# EAGLE design ultra-violet-tooth-sensor-mk-3.3 (EAGLE 6.5.0)
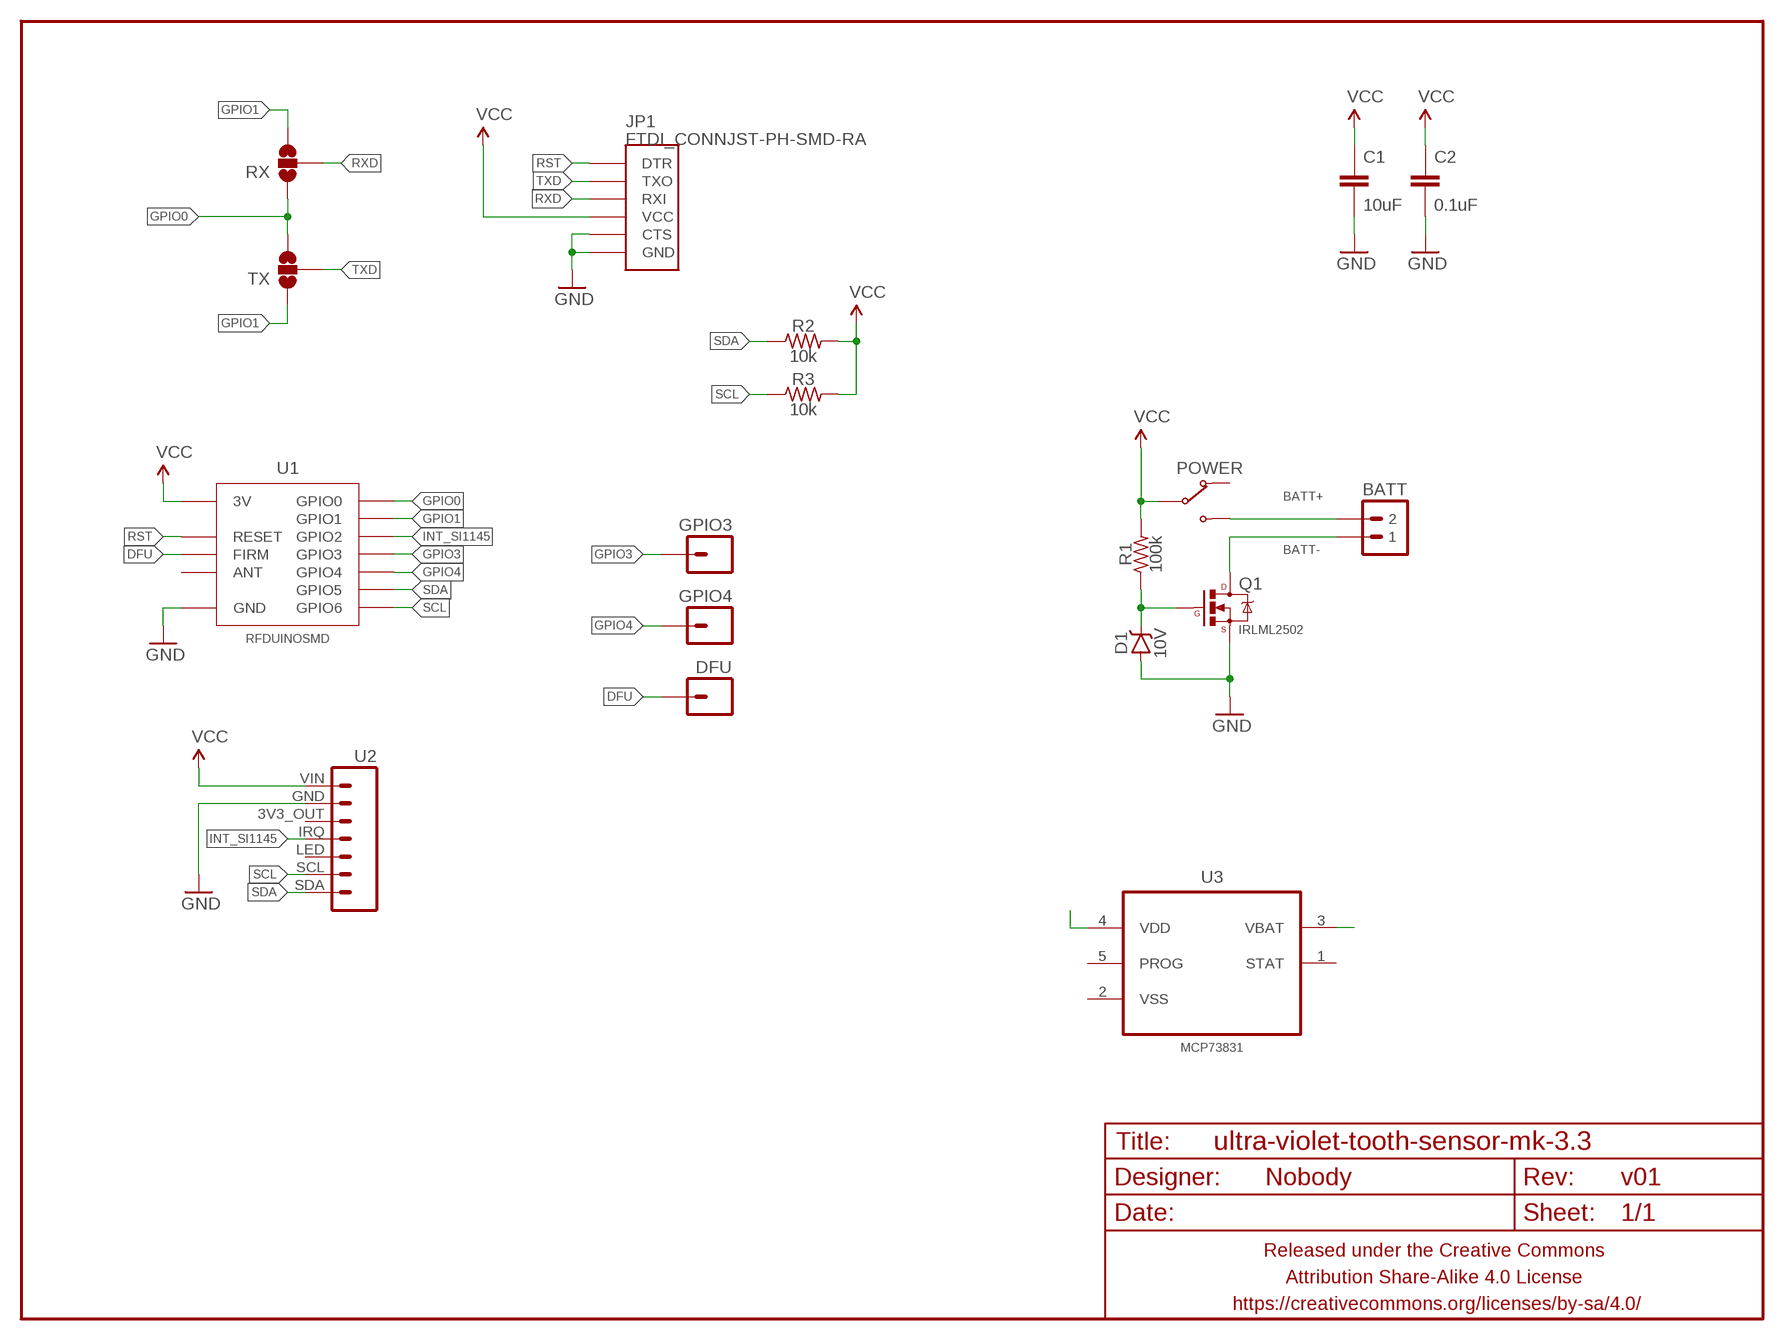
[diagram p0: schematic, sheet 1]

## Parts
BATT  M02PTH-CENTERED-R+  [1X02-CENTER-R+]
C1  10uF  CAPACITOR-CERAMICC1206  [C1206]
C2  0.1uF  CAPACITOR-CERAMICC0805  [C0805]
D1  10V  DIODE-ZENERSOT23  [SOT23]
DFU  M01SMD_1.5X2MM  [1X01_1.5X2MM]
FRAME1  FRAME-LETTERNO_PACKAGE  [DUMMY]
GPIO3  M01SMD_1.5X2MM  [1X01_1.5X2MM]
GPIO4  M01SMD_1.5X2MM  [1X01_1.5X2MM]
JP1  FTDI_CONNJST-PH-SMD-RA  [AVRISP-JST-6-PH-RA-SMD]
POWER  SWITCH-SPDTPTH-RA-2.54MM  [SPDT-RA-2.54MM]
Q1  IRLML2502  MOSFET-NCHANNELIRLML2502  [SOT23]
R1  100k  RESISTORR0805  [R0805]
R2  10k  RESISTORR0805  [R0805]
R3  10k  RESISTORR0805  [R0805]
RX  JUMPER-PAD-3-NOFULL_BOX_SILK  [PAD-JUMPER-3-NO_YES_SILK_FULL_BOX]
TX  JUMPER-PAD-3-NOFULL_BOX_SILK  [PAD-JUMPER-3-NO_YES_SILK_FULL_BOX]
U1  RFDUINOSMD  [RFDUINO-SMD]
U2  ADAFRUIT-SI1145-BREAKOUTNOHOLEY  [ADAFRUIT-SI1145-BREAKOUT-NOHOLES]
U3  MCP73831  MCP73831T-2ACI/OT  [SOT95P280X145-5N]

## Nets
BATT+: BATT.2 POWER.3(NO)
BATT-: BATT.1 Q1.3(D)
DFU: DFU.P$1 U1.FACTORY(FIRM)
GND: C1.2 C2.2 D1.1(A) D1.2(A) JP1.CTS JP1.GND Q1.2(S) U1.GND@1(GND) U1.GND@2(GND) U1.GND@3(GND) U1.GND@4(GND) U1.GND@5(GND) U1.GND@6(GND) U1.GND@7(GND) U1.GND@8(GND) U2.GND
GPIO0: RX.1 TX.3 U1.GPIO0
GPIO1: RX.3 TX.1 U1.GPIO1
GPIO3: GPIO3.P$1 U1.GPIO3
GPIO4: GPIO4.P$1 U1.GPIO4
INT_SI1145: U1.GPIO2 U2.IRQ
N$1: U3.3(VBAT)
N$3: U3.4(VDD)
N$4: D1.3(C) Q1.1(G) R1.1
RST: JP1.DTR U1.RESET
RXD: JP1.RXI RX.2
SCL: R3.1 U1.GPIO6 U2.SCL
SDA: R2.1 U1.GPIO5 U2.SDA
TXD: JP1.TXO TX.2
VCC: C1.1 C2.1 JP1.VCC POWER.2(COM) R1.2 R2.2 R3.2 U1.3V U2.VIN
Unconnected: POWER.1(NC) U1.ANT U2.3V3_OUT U2.LED U3.1(STAT) U3.5(PROG)

## Power pins joined to a net without a drawn wire
VSS: U3.2(VSS)

## Library data of the parts
BATT = A_butts:M02: Standard 2-pin 0.1" header. Use with - straight break away headers ( PRT-00116) - right angle break away headers (PRT-00553) - swiss pins (PRT-00743) - machine pins (PRT-00117) - female headers (PRT-00115) Molex polarized connector foot print use with: PRT-08233 with associated crimp pins and housings. 2.54_SCREWTERM for use with PRT-10571. 3.5mm Screw Terminal footprints for PRT-08084 5mm Screw Terminal footprints for use with PRT-08433
C1 C2 = A_butts:CAPACITOR-CERAMIC: CAPACITOR, European symbol
D1 = A_butts:DIODE-ZENER: Zener Diode Production Part - 8199 3.4V Zener Voltage
DFU GPIO3 GPIO4 = A_butts:M01: Header 1 Standard 1-pin 0.1" header. Use with straight break away headers (SKU : PRT-00116), right angle break away headers (PRT-00553), swiss pins (PRT-00743), machine pins (PRT-00117), and female headers (PRT-00115).
FRAME1 = A_butts:FRAME-LETTER: Schematic Frame Standard 8.5x11 US Letter frame; DESIGNER: Nobody; VERSION: v01
JP1 = A_butts:FTDI_CONN: Connector which mates to FTDI basic or FTDI cable.
POWER = A_butts:SWITCH-SPDT
Q1 = A_butts:MOSFET-NCHANNEL: Common NMOSFET Parts MFG P/N Store ID Prod ID FDD8780 TRANS-09984 SI7820DN TRANS-11055 FDS6630A IC-08089 2N7002PW TRANS-11151 FQP30N06L COM-10213 TRANS-10060 BSS123LT1G TRANS-08345 BSS138 TRANS-00830 BS170 2N7000
R1-R3 = A_butts:RESISTOR: RESISTOR, American symbol
RX TX = A_butts:JUMPER-PAD-3-NO
U1 = A_butts:RFDUINO
U2 = A_butts:ADAFRUIT-SI1145-BREAKOUT
U3 = A_butts:MCP73831T-2ACI/OT: Charge Management Controller; MPN: MCP73831T-2ACI/OT; OC_FARNELL: 1332158; OC_NEWARK: 56K7045; PACKAGE: SOT-5; SUPPLIER: Microchip

## Board
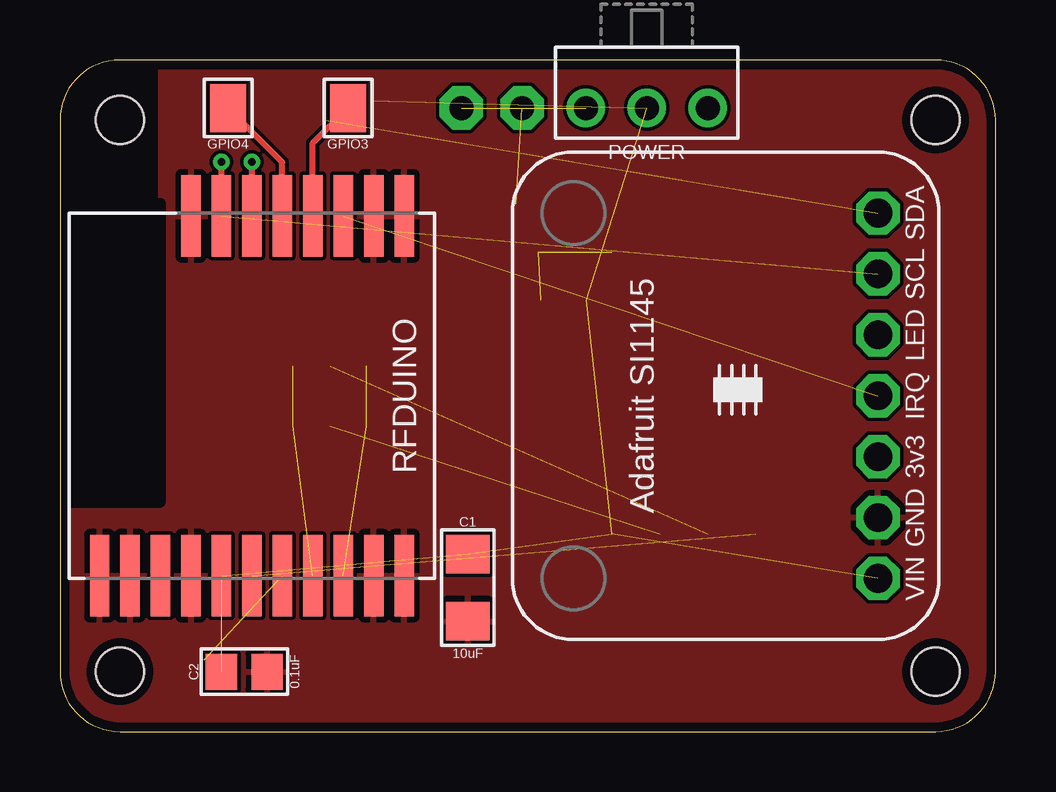
[diagram p1: board, top side]
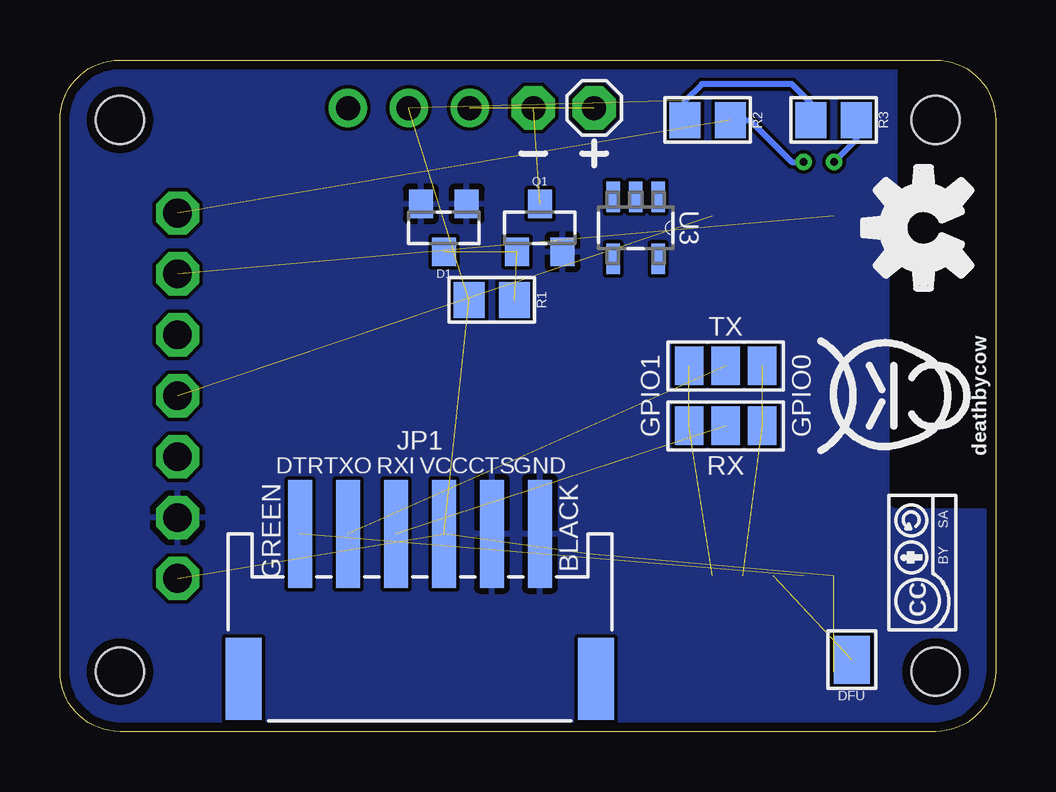
[diagram p2: board, bottom side, seen from below]

Size 39 x 28 mm. Coordinates in mm from the lower left corner, seen from the top.
Outline: 0,25.5 0,2.5 arc90 2.5,0 36.5,0 arc90 39,2.5 39,25.5 arc90 36.5,28 2.5,28 arc90 0,25.5
Copper layers (1*16): Top 0.0356mm / dielectric 1.5011mm / Bottom 0.0356mm
Design rules "LaenPCBOrder_2": minimum track width 6mil, minimum drill 13mil, track to track 6mil, track to pad 6mil, pad to pad 6mil, via to via 6mil, smd to smd 6mil, copper to edge 15mil, drill to drill 6mil, minimum pad ring 7mil, minimum via ring 7mil, stop-mask expansion 3mil, vias tented up to drill 20mil, thermal gap 10mil
Holes 2 mm at 2.5,25.5 2.5,2.5 36.5,25.5 36.5,2.5

### Footprints (pad centres in the part's own frame; a part is rotated, then mirrored left to right if it is on the bottom)
1X02-CENTER-R+ = drill 1 pad 1.8 octagon: 1 -1.27,0; 2 1.27,0
C1206 = smd 1.6 x 1.8: 1 -1.4,0; 2 1.4,0
C0805 = smd 1.3 x 1.5: 1 -0.95,0; 2 0.95,0
SOT23 = smd 1 x 1.2: 1 -0.95,-1; 2 0.95,-1; 3 0,1
1X01_1.5X2MM = smd 1.5 x 2: P$1 0,0
AVRISP-JST-6-PH-RA-SMD = smd 1 x 4.5: CTS -3,0; DTR 5,0; GND -5,0; RXI 1,0; TXO 3,0; VCC -1,0 | smd 1.5 x 3.4: G@1 -7.35,6.05; G@2 7.35,6.05
SPDT-RA-2.54MM = drill 1 pad 1.6: 1 0,0; 2 2.54,0; 3 5.08,0
R0805 = smd 1.3 x 1.5: 1 -0.95,0; 2 0.95,0
PAD-JUMPER-3-NO_YES_SILK_FULL_BOX = smd 1.2 x 1.6: 1 -1.524,0; 2 0,0; 3 1.524,0
RFDUINO-SMD = smd 3.4 x 0.8: 3V 7.5,-1.27; ANT 7.5,-3.81; FACTORY 7.5,1.27; GND@1 -7.5,6.35; GND@2 -7.5,5.08; GND@3 -7.5,-2.54; GND@4 7.5,-6.35; GND@5 7.5,-5.08; GND@6 7.5,-2.54; GND@7 7.5,5.08; GND@8 7.5,6.35; GPIO0 7.5,2.54; GPIO1 7.5,3.81; GPIO2 -7.5,3.81; GPIO3 -7.5,2.54; GPIO4 -7.5,1.27; GPIO5 -7.5,0; GPIO6 -7.5,-1.27; RESET 7.5,0
ADAFRUIT-SI1145-BREAKOUT-NOHOLES = drill 1.2 pad 1.8 octagon: 3V3_OUT -2.54,-6.35; GND -5.08,-6.35; IRQ 0,-6.35; LED 2.54,-6.35; SCL 5.08,-6.35; SDA 7.62,-6.35; VIN -7.62,-6.35
SOT95P280X145-5N = smd 1.27 x 0.559: 1 -1.295,0.94; 2 -1.295,0; 3 -1.295,-0.94; 4 1.295,-0.94; 5 1.295,0.94

### Placement (x,y rotation side)
BATT  18,26 0 bottom
C1  17,6 270 top
C2  7.68,2.5 0 top
D1  23,21 180 bottom
DFU  6,3 180 bottom
FRAME1  0,0 180 top
GPIO3  12,26 180 top
GPIO4  7,26 180 top
JP1  24,8.25 180 bottom
POWER  27,26 180 top
Q1  19,21 0 bottom
R1  21,18 180 bottom
R2  12,25.5 180 bottom
R3  6.75,25.5 180 bottom
RX  11.25,12.75 180 bottom
TX  11.25,15.25 0 bottom
U1  8,14 270 top
U2  27.75,14 90 top
U3  15,21 270 bottom
U$1  [CC-BY-SA-4.0-NO-URL]  3.05,7.05 90 bottom
U$2  [COW_SMALL]  4.75,14 90 bottom
U$6  [OSHWLOGO_SILKONLY]  3,21 90 bottom

### Tracks (layer width: path | path; a pad name or v marks a point on that pad's centre or on a via)
BATT+  (1 unrouted)
BATT-  (1 unrouted)
DFU  (1 unrouted)
GND
  pour Top (isolate 0.152, rank 6): 39.1,28.1 39.1,-0.1 -0.1,-0.1 -0.1,9.5 4.15,9.5 4.15,28.1
  pour Bottom (isolate 0.152, rank 6): 39.1,28.1 39.1,-0.1 -0.1,-0.1 -0.1,9.5 4.15,9.5 4.15,28.1
GPIO0  (2 unrouted)
GPIO1  (2 unrouted)
GPIO3
  Top 0.25: U1.GPIO3 10.54,24.54 GPIO3.P$1
GPIO4
  Top 0.25: U1.GPIO4 9.27,23.73 GPIO4.P$1
INT_SI1145  (1 unrouted)
N$4  (2 unrouted)
RST  (1 unrouted)
RXD  (1 unrouted)
SCL  (via drill 0.33)  (1 unrouted)
  Top 0.25: U1.GPIO6 v6.73,23.75
  Bottom 0.25: v6.73,23.75 5.8,24.68 R3.1
SDA  (via drill 0.33)  (1 unrouted)
  Top 0.25: U1.GPIO5 v8,23.75
  Bottom 0.25: R2.1 10.25,25.5 8.5,23.75 v8,23.75
TXD  (1 unrouted)
VCC  (7 unrouted)
  Bottom 0.25: R2.2 12.95,26.3 12.25,27 8.5,27 7.7,26.2 R3.2

### Text on the board
tPlace: Ultraviolet Tooth
bPlace: Ultraviolet Tooth | by schizobovine <sean@yak.net> | GPIO0 | GPIO1